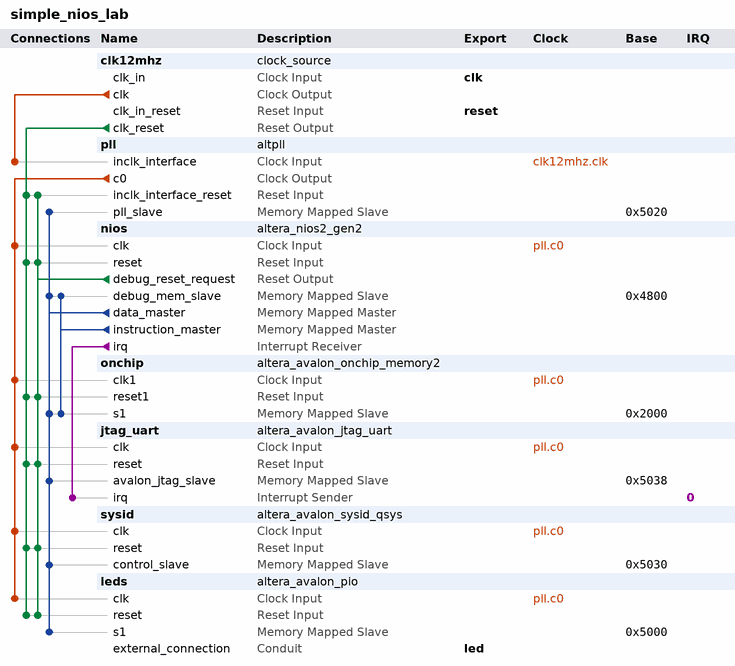
[diagram p0: system contents]
# Platform Designer (Qsys) system simple_nios_lab, MAX 10 10M08SAU169C8G
# Parameters at their usual value, and those the tool derives, are not listed.
package require -exact qsys 18.0
create_system simple_nios_lab
set_project_property DEVICE_FAMILY {MAX 10}
set_project_property DEVICE 10M08SAU169C8G

add_instance clk12mhz clock_source 18.0
set_instance_parameter_value clk12mhz clockFrequency 12000000

add_instance pll altpll 18.0
set_instance_parameter_value pll CLK0_DIVIDE_BY 6
set_instance_parameter_value pll CLK0_MULTIPLY_BY 25
set_instance_parameter_value pll INCLK0_INPUT_FREQUENCY 83333
set_instance_parameter_value pll PORT_ARESET PORT_UNUSED
set_instance_parameter_value pll PORT_LOCKED PORT_UNUSED
set_instance_parameter_value pll PORT_clk1 PORT_UNUSED
set_instance_parameter_value pll PORT_clk2 PORT_UNUSED
set_instance_parameter_value pll PORT_clk3 PORT_UNUSED

add_instance nios altera_nios2_gen2 18.0
set_instance_parameter_value nios dcache_size 2048
set_instance_parameter_value nios exceptionSlave onchip.s1
set_instance_parameter_value nios icache_size 4096
set_instance_parameter_value nios impl Tiny
set_instance_parameter_value nios resetSlave onchip.s1

add_instance onchip altera_avalon_onchip_memory2 18.0
set_instance_parameter_value onchip dataWidth 32
set_instance_parameter_value onchip dualPort false
set_instance_parameter_value onchip initMemContent true
set_instance_parameter_value onchip initializationFileName onchip_mem.hex
set_instance_parameter_value onchip memorySize 8192

add_instance jtag_uart altera_avalon_jtag_uart 18.0
set_instance_parameter_value jtag_uart simInteractiveOptions NO_INTERACTIVE_WINDOWS

add_instance sysid altera_avalon_sysid_qsys 18.0
set_instance_parameter_value sysid id 338609

add_instance leds altera_avalon_pio 18.0
set_instance_parameter_value leds bitModifyingOutReg true
set_instance_parameter_value leds direction Output
set_instance_parameter_value leds width 8

# connections
add_connection clk12mhz.clk pll.inclk_interface clock
add_connection pll.c0 jtag_uart.clk clock
add_connection pll.c0 leds.clk clock
add_connection pll.c0 nios.clk clock
add_connection pll.c0 onchip.clk1 clock
add_connection pll.c0 sysid.clk clock
add_connection clk12mhz.clk_reset jtag_uart.reset reset
add_connection clk12mhz.clk_reset leds.reset reset
add_connection clk12mhz.clk_reset nios.reset reset
add_connection clk12mhz.clk_reset onchip.reset1 reset
add_connection clk12mhz.clk_reset pll.inclk_interface_reset reset
add_connection clk12mhz.clk_reset sysid.reset reset
add_connection nios.debug_reset_request jtag_uart.reset reset
add_connection nios.debug_reset_request leds.reset reset
add_connection nios.debug_reset_request nios.reset reset
add_connection nios.debug_reset_request onchip.reset1 reset
add_connection nios.debug_reset_request pll.inclk_interface_reset reset
add_connection nios.debug_reset_request sysid.reset reset
add_connection nios.data_master jtag_uart.avalon_jtag_slave avalon
set_connection_parameter_value nios.data_master/jtag_uart.avalon_jtag_slave baseAddress 0x5038
add_connection nios.data_master leds.s1 avalon
set_connection_parameter_value nios.data_master/leds.s1 baseAddress 0x5000
add_connection nios.data_master nios.debug_mem_slave avalon
set_connection_parameter_value nios.data_master/nios.debug_mem_slave baseAddress 0x4800
add_connection nios.data_master onchip.s1 avalon
set_connection_parameter_value nios.data_master/onchip.s1 baseAddress 0x2000
add_connection nios.data_master pll.pll_slave avalon
set_connection_parameter_value nios.data_master/pll.pll_slave baseAddress 0x5020
add_connection nios.data_master sysid.control_slave avalon
set_connection_parameter_value nios.data_master/sysid.control_slave baseAddress 0x5030
add_connection nios.instruction_master nios.debug_mem_slave avalon
set_connection_parameter_value nios.instruction_master/nios.debug_mem_slave baseAddress 0x4800
add_connection nios.instruction_master onchip.s1 avalon
set_connection_parameter_value nios.instruction_master/onchip.s1 baseAddress 0x2000
add_connection nios.irq jtag_uart.irq interrupt
set_connection_parameter_value nios.irq/jtag_uart.irq irqNumber 0

# exported interfaces
add_interface clk clock sink
set_interface_property clk EXPORT_OF clk12mhz.clk_in
add_interface led conduit end
set_interface_property led EXPORT_OF leds.external_connection
add_interface reset reset sink
set_interface_property reset EXPORT_OF clk12mhz.clk_in_reset

set_interconnect_requirement {$system} qsys_mm.clockCrossingAdapter HANDSHAKE
set_interconnect_requirement {$system} qsys_mm.enableEccProtection FALSE
set_interconnect_requirement {$system} qsys_mm.insertDefaultSlave FALSE
set_interconnect_requirement {$system} qsys_mm.maxAdditionalLatency 1

save_system simple_nios_lab.qsys
